# Altium schematic sheet FPGA_CLK.SchDoc: FPGA CLOCK
size A4; DocumentNumber: 8; SheetNumber: 8; SheetTotal: 18
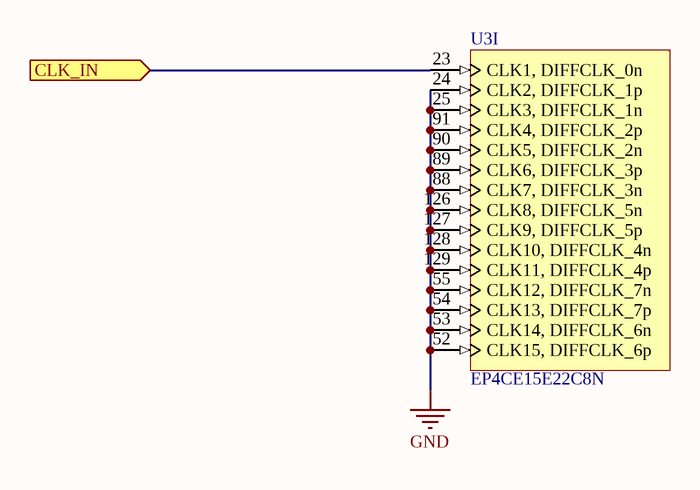
[diagram p0: FPGA_CLK.SchDoc]

## Parts
U3  EP4CE15E22C8N  [EQFP144_A-165_D2-67_N]  (part I of 13)

## Ports
CLK_IN (in)

## Nets
GND: U3.24(CLK2,_DIFFCLK_1p) U3.25(CLK3,_DIFFCLK_1n) U3.52(CLK15,_DIFFCLK_6p) U3.53(CLK14,_DIFFCLK_6n) U3.54(CLK13,_DIFFCLK_7p) U3.55(CLK12,_DIFFCLK_7n) U3.88(CLK7,_DIFFCLK_3n) U3.89(CLK6,_DIFFCLK_3p) U3.90(CLK5,_DIFFCLK_2n) U3.91(CLK4,_DIFFCLK_2p) U3.126(CLK8,_DIFFCLK_5n) U3.127(CLK9,_DIFFCLK_5p) U3.128(CLK10,_DIFFCLK_4n) U3.129(CLK11,_DIFFCLK_4p)
CLK_IN: U3.23(CLK1,_DIFFCLK_0n) ; port CLK_IN

## Notes on the sheet
- Title
- Size:
- Date:
- A4
- Number:
- Time:
- Revision:
- Sheet
- of
- File:

## Library data of the parts
U3 = EP4CE15E22C8N: Cyclone IV Family FPGA, 1.2V Core, 81 I/O Pins, 4 PLLs, 144-Pin QFP, Speed Grade 8, Commercial Grade, Pb-Free; Manufacturer: Altera; DatasheetVersion: ver1.6, Nov-2011; PackageVersion: ver1.0, Jun-2011; PackageReference: EQFP144_A-165_D2-67; PackageDescription: 144-Pin Plastic Enhanced Quad Flat Pack (EQFP) - Wire Bond - A:1.65 - D2:6.7; Code_JEDEC: MS-026-BFB-HD; ComponentLink1Description: Manufacturer URL; ComponentLink1URL: http://www.altera.com/; ComponentLink2Description: Handbook; ComponentLink2URL: http://www.altera.com/literature/hb/cyclone-iv/cyclone4-handbook.pdf; ComponentLink3Description: Pinout; ComponentLink3URL: http://www.altera.com/literature/lit-dp.jsp?category=cyc%204&showspreadsheet=y; ComponentLink4Description: Package Specification; ComponentLink4URL: http://www.altera.com/devicepackaging/04R00221-02.pdf